# EasyEDA Pro project Balanced_Car.epro, schematic Schematic2
Board Name: V2; Create Date: 2024-09-10; Page Name: P1; Project Name: 平衡车; Schematic Name: Schematic2; Update Date: 2024-10-18; Company: 嘉立创EDA; Page Size: A4; Version: V1.0
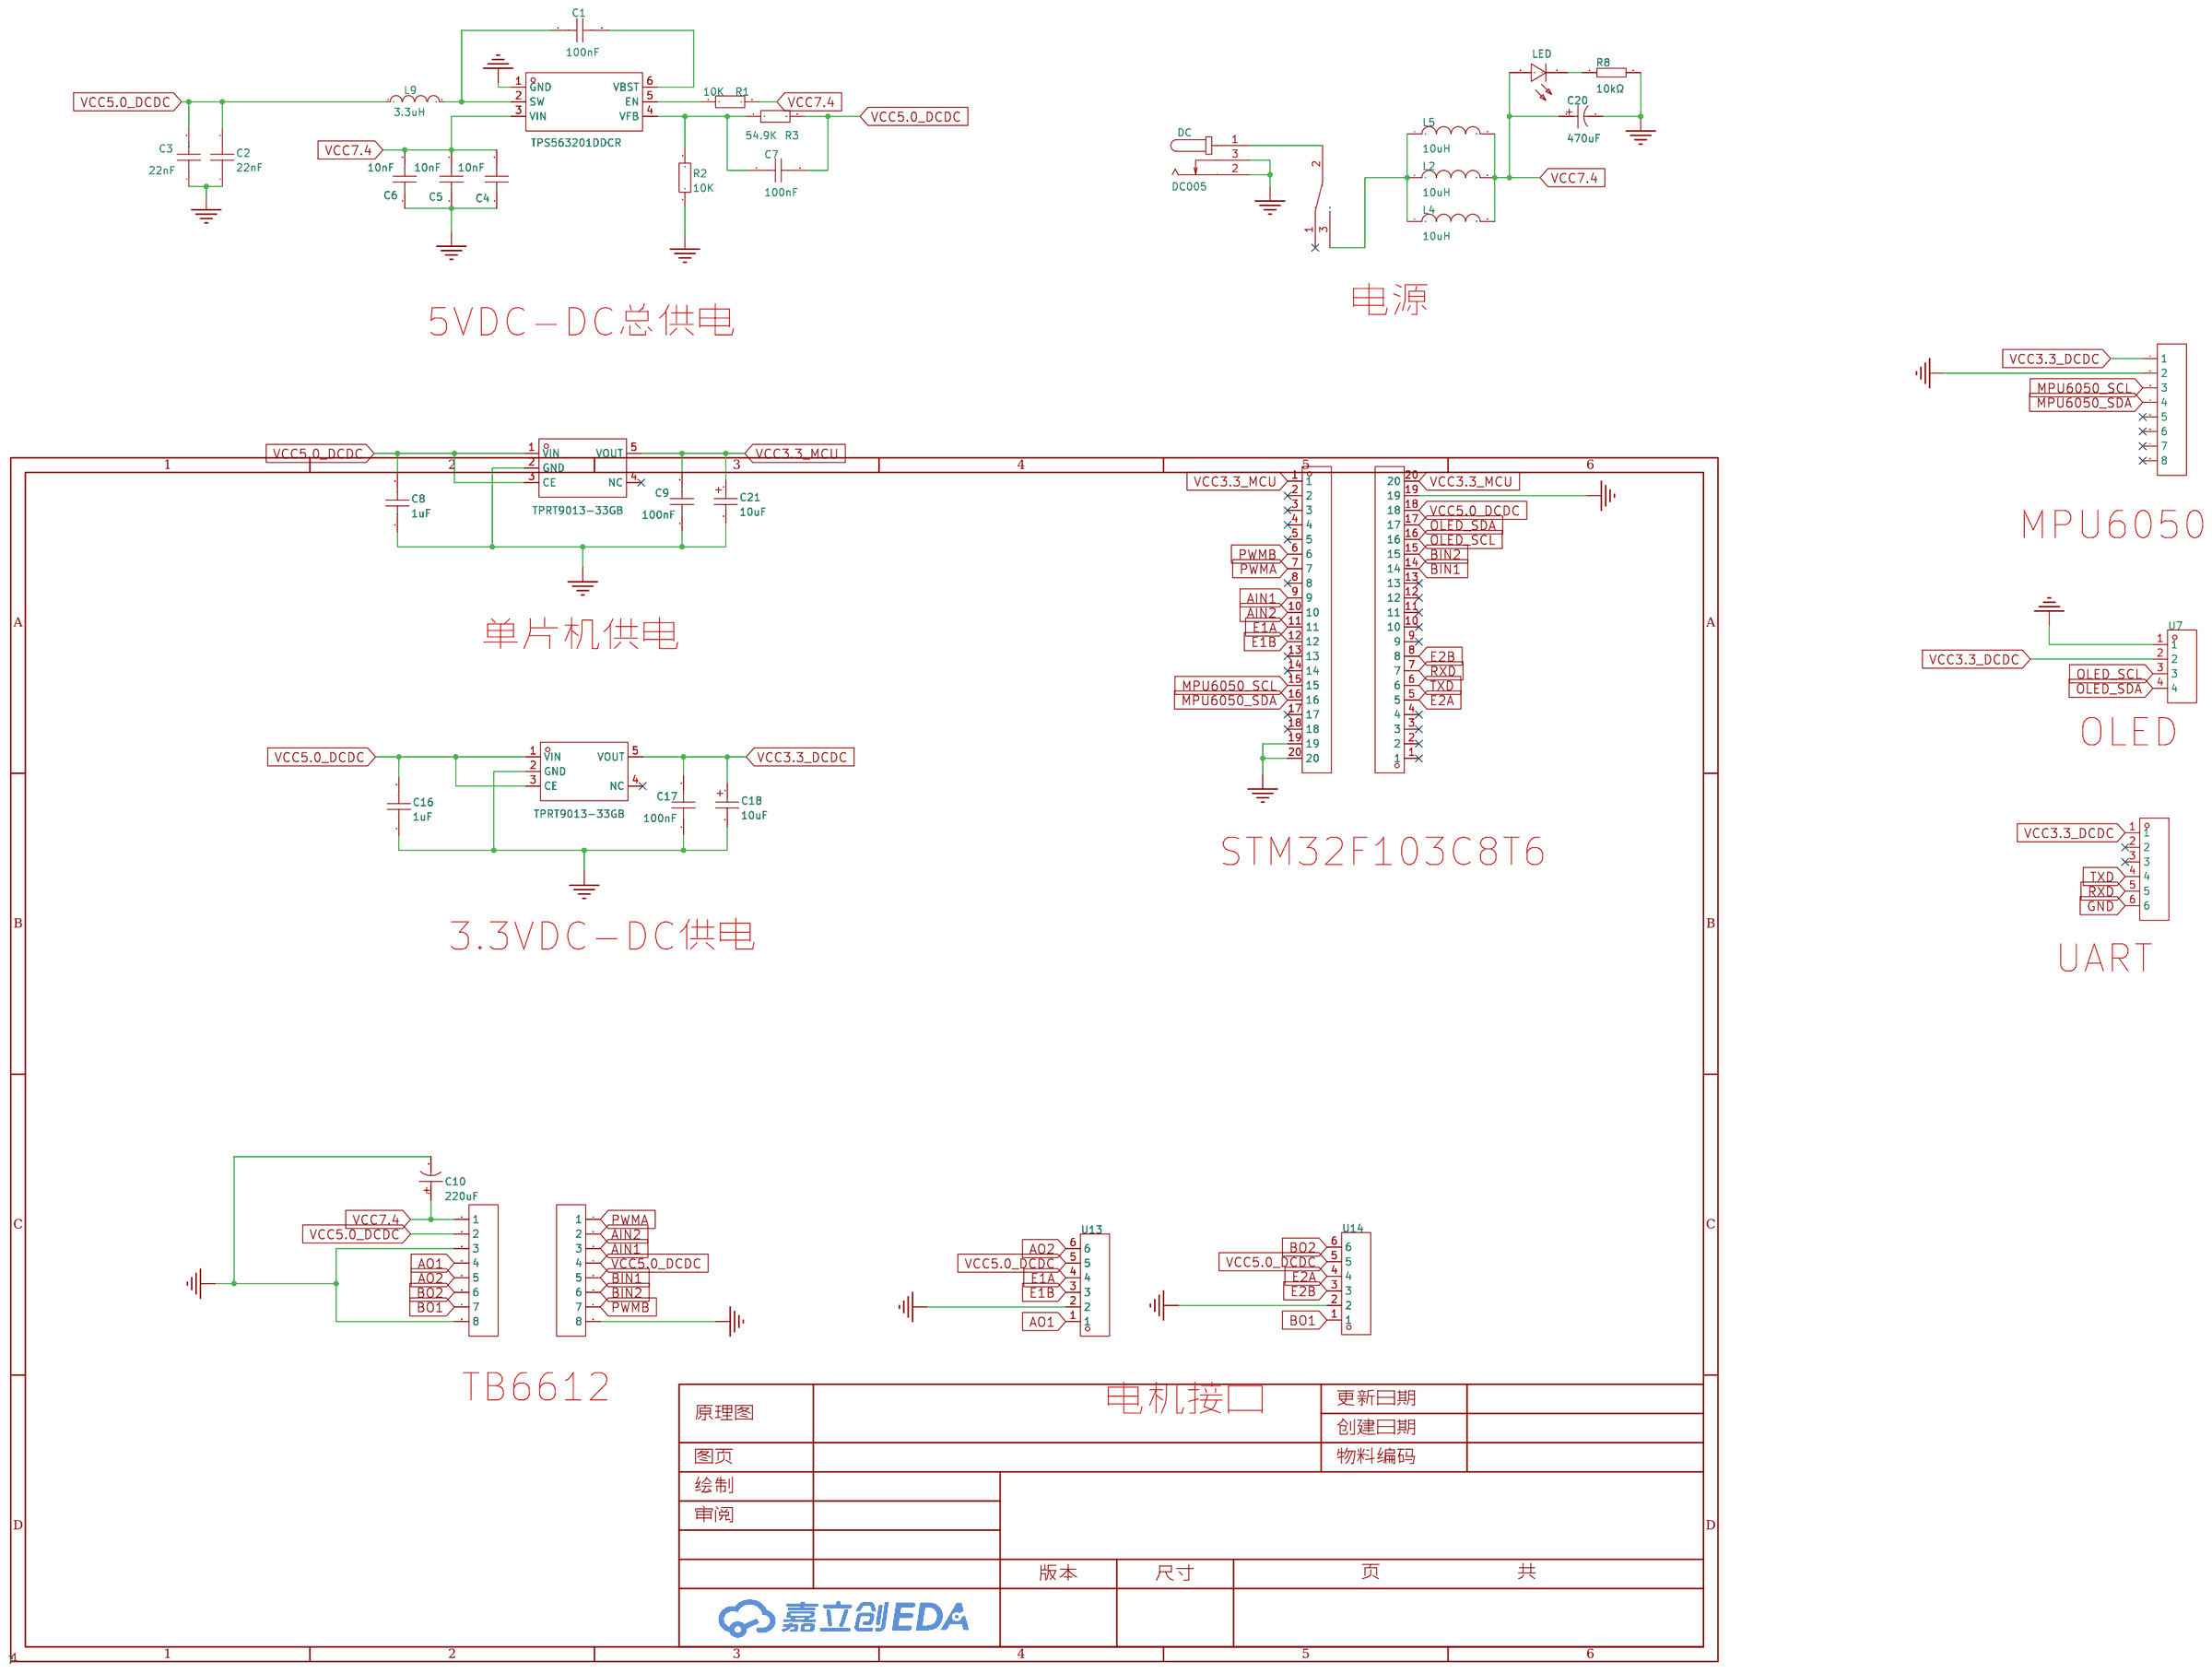
[diagram p0: schematic sheet]

## Parts
C1  100nF  [C0603]
C2  22nF  [C0603]
C3  22nF  [C0603]
C4  10nF  [C0603]
C5  10nF  [C0603]
C6  10nF  [C0603]
C7  100nF  [C0603]
C8  1uF  [C0603]
C9  100nF  [C0603]
C10  220uF  [CAP-TH_BD6.3-P2.50-D1.0-FD]
C16  1uF  [C0603]
C17  100nF  [C0603]
C18  10uF  [CAP-SMD_L3.2-W1.6-RD-C7171]
C20  470uF  [CAP-TH_BD8.0-P3.50-D0.6-FD]
C21  10uF  [CAP-SMD_L3.2-W1.6-RD-C7171]
DC  DC005  [DC-IN-TH_DC005]
H7  -  [HDR-TH_8P-P2.54-V-F-1]
H8  PM254V-11-06-H85  [HDR-TH_6P-P2.54-V-F]
L2  10uH  [L0805]
L4  10uH  [L0805]
L5  10uH  [L0805]
L9  3.3uH  [IND-SMD_L7.0-W6.6]
LED  NCD0603G1  [LED0603-RD]
R1  10K  [R0603]
R2  10K  [R0603]
R3  54.9K  [R0603]
R8  10kΩ  [R0805]
U1  TPS563201DDCR  [SOT-23-6_L2.9-W1.6-P0.95-LS2.8-BR]
U2  -  [HDR-TH_8P-P2.54-V-F-1]
U3  TPRT9013-33GB  [SOT-23-5_L3.0-W1.7-P0.95-LS2.8-BL]
U5  -  [HDR-TH_8P-P2.54-V-F-1]
U6  TPRT9013-33GB  [SOT-23-5_L3.0-W1.7-P0.95-LS2.8-BL]
U7  PM2.54-1*4  [HDR-TH_4P-P2.54-V-F]
U11  KH-2.54FH-1X20P-H8.5  [HDR-TH_20P-P2.54-V-F-2]
U12  KH-2.54FH-1X20P-H8.5  [HDR-TH_20P-P2.54-V-F-2]
U13  X8821WR-06S-N0SN  [CONN-TH_6P-P2.50_X8821WR-06S-N2SN]
U14  X8821WR-06S-N0SN  [CONN-TH_6P-P2.50_X8821WR-06S-N2SN]
U16  MT-0-102-A101-M200-RS  [SW-TH_MT-0-103-A101-M200-RS]

## Library data of the parts
C1-C9 C16 C17 = CAP_0603: Supplier Footprint: 0603
C10 = KS227M016E07RR0VH2FP0: 容值:220uF;精度:±20%;额定电压:16V;纹波电流:-;等效串联电阻:-;; LCSC Part Name: 220uF ±20% 16V; Supplier Part: C43340; Manufacturer: CX(承兴); Supplier Footprint: 插件,D6.3xL7mm; JLCPCB Part Class: 扩展库; Datasheet: https://atta.szlcsc.com/upload/public/pdf/source/20211027/7B10195EF01EB9374BE8935690E3D906.pdf; Supplier: LCSC; Tolerance: ±20%; Rated Voltage: 16V; Lead Spacing: 2.5mm; φD: 6.3mm; L: 7mm; Lifetime @ Temp: 1000hrs@105℃; Operating Temperature: -40℃~+105℃
C18 C21 = TAJA106K016RNJ: 容值:10uF;精度:±10%;额定电压:16V;等效串联电阻:3Ω@100kHz;; LCSC Part Name: 10uF ±10% 16V; Supplier Part: C7171; Manufacturer: Kyocera AVX; Supplier Footprint: CASE-A-3216; JLCPCB Part Class: 基础库; Datasheet: https://atta.szlcsc.com/upload/public/pdf/source/20160107/1457707750344.pdf; Supplier: LCSC; Tolerance: ±10%; Rated Voltage: 16V; Equivalent Series Resistance(ESR): 3Ω@100kHz; Operating Temperature: -55℃~+125℃
C20 = KM477M025F12RR0VH2FP0: 容值:470uF;精度:±20%;额定电压:25V;; LCSC Part Name: 470uF ±20% 25V; Supplier Part: C43839; Manufacturer: CX(承兴); Supplier Footprint: 插件,D8xL12mm; JLCPCB Part Class: 扩展库; Datasheet: https://atta.szlcsc.com/upload/public/pdf/source/20230915/80F12A3CAB98DAEEC2984174CA9E6511.pdf; Supplier: LCSC; Tolerance: ±20%; Rated Voltage: 25V; Lead Spacing: 3.5mm; φD: 8mm; L: 12mm; Lifetime @ Temp: 2000hrs@105℃
DC = DC005: 连接器类型:DC电源插座;安装方式:弯插;触点内径:2mm;触点外径:6.3mm;额定电流:500mA;额定电压:30V;工作温度范围:-40℃~+55℃;; LCSC Part Name: DC电源插座 内径:2mm 外径:6.3mm; Supplier Part: C431533; Manufacturer: SHOU HAN(首韩); Supplier Footprint: 插件; JLCPCB Part Class: 扩展库; Datasheet: https://atta.szlcsc.com/upload/public/pdf/source/20190925/C431533_4751811035784AC1D38EBC85F7905E99.pdf; Supplier: LCSC; Connector Type: DC电源插座; Mounting Style: 弯插; Inside Contact Diameter: 2mm; Outside Contact Diameter: 6.3mm; Current Rating (Max): 500mA; Voltage Rating (Max): 30V; Operating Temperature Range: -40℃~+55℃
H7 U2 U5 = HDR-F_2.54_1x8P: Supplier Part: C27438; Supplier Footprint: 插件; JLCPCB Part Class: 扩展库
H8 = PM254V-11-06-H85: 插孔结构:1x6P;间距:2.54mm;行距:-;圆孔/方孔:方孔;安装类型:直插;排数:单排;总孔位数:6P;额定电流:3A;额定电压:250V;插孔方向:顶部;塑高:-;工作温度范围:-40℃~+105℃;; LCSC Part Name: 间距:2.54mm 1x6P 直插; Supplier Part: C2832269; Manufacturer: XFCN(兴飞); Supplier Footprint: 插件,P=2.54mm; JLCPCB Part Class: 扩展库; Datasheet: https://atta.szlcsc.com/upload/public/pdf/source/20210514/C2832269_B3EC97736B37C2783BDCE3050AA57447.pdf; Supplier: LCSC; Holes Structure: 1x6P; Pitch: 2.54mm; Circular Hole / Square Hole: 方孔; Mounting Type: 直插; Number of Rows: 单排; Number of Holes: 6P; Current Rating (Max): 3A; Voltage Rating (Max): 250V; Holes Direction: 顶部; Operating Temperature Range: -40℃~+105℃
L2 L4 L5 = MGFL2012F100MT-LF: 电感值:10uH;精度:±20%;额定电流:500mA;饱和电流(Isat):-;直流电阻(DCR):320mΩ;; LCSC Part Name: 10uH ±20%; Supplier Part: C281113; Manufacturer: microgate(麦捷科技); Supplier Footprint: 0805; JLCPCB Part Class: Extended Part; Datasheet: https://atta.szlcsc.com/upload/public/pdf/source/20181025/C281113_18633E3AF8F2E9832A865B8532475DE8.pdf; Supplier: LCSC; Tolerance: ±20%; Rated Current: 500mA; DC Resistance (DCR): 320mΩ; Design Item ID: IND; Library Name: Fly
L9 = FXL0630-3R3-M: 电感值:3.3uH;精度:±20%;额定电流:8.5A;饱和电流(Isat):9.5A;类型:一体成型电感;; LCSC Part Name: 3.3uH ±20% 9.5A; Supplier Part: C167219; Manufacturer: cjiang(长江微电); Supplier Footprint: SMD,6.6x7mm; JLCPCB Part Class: 扩展库; Datasheet: https://atta.szlcsc.com/upload/public/pdf/source/20230516/3A080F5AF8C87BB81C3BA86E5F60E51A.pdf; Supplier: LCSC; Tolerance: ±20%; Rated Current: 8.5A; Saturation Current (Isat): 9.5A; DC Resistance (DCR): 22mΩ; Type: 一体成型电感
LED = NCD0603G1: 发光颜色:翠绿色;正向电压(VF):2.6V~3.6V;功率:72mW;正向电流:10mA;主波长:515nm~530nm;透镜颜色:无色透明透镜;发光强度:330mcd~900mcd;发光角度:130°;工作温度:-30℃~+85℃;; Supplier Part: C84267; Manufacturer: 国星光电; Supplier Footprint: 0603; JLCPCB Part Class: 扩展库; Datasheet: https://atta.szlcsc.com/upload/public/pdf/source/20200820/C84267_04BA7703640BAC111D09F5EFB971FBF3.pdf; Supplier: LCSC; Emitted Color: 翠绿色; Forward Voltage (VF): 2.6V~3.6V; Power Dissipation: 72mW; Forward Current: 10mA; Dominant Wavelength: 515nm~530nm; Lens Color: 无色透明透镜; Luminous Intensity: 330mcd~900mcd; Viewing Angle: 130°; Operating Temperature: -30℃~+85℃
R1-R3 = Res_0603: Supplier Footprint: 0603
R8 = 0805W8F1501T5E: 电阻类型:厚膜电阻;阻值:1.5kΩ;精度:±1%;功率:125mW;最大工作电压:150V;温度系数:±100ppm/℃;; LCSC Part Name: 1.5kΩ ±1% 125mW 厚膜电阻; Supplier Part: C4310; Manufacturer: UNI-ROYAL(厚声); Supplier Footprint: 0805; JLCPCB Part Class: Basic Part; Datasheet: https://atta.szlcsc.com/upload/public/pdf/source/20200306/C422600_1E6D84923E4A46A82E41ADD87F860B5C.pdf; Supplier: LCSC; Type: 厚膜电阻; Tolerance: ±1%; Power(Watts): 125mW; Overload Voltage (Max): 150V; Temperature Coefficient: ±100ppm/℃; Operating Temperature Range: -55℃~+155℃; Design Item ID: RES; Library Name: Fly
U1 = TPS563201DDCR: 功能类型:降压型;输出类型:可调;输入电压:4.5V~17V;输出电压:768mV~7V;输出电流:3A;; Supplier Part: C116592; Manufacturer: TI(德州仪器); Supplier Footprint: SOT-23-THIN-6; JLCPCB Part Class: 扩展库; Datasheet: https://atta.szlcsc.com/upload/public/pdf/source/20230424/FEEFD13F14AFA838E4C009B2DDC1DFA0.pdf; Supplier: LCSC; Function: 降压型; Output Type: 可调; Input Voltage: 4.5V~17V; Output Voltage: 768mV~7V; Output Current: 3A; Switching Frequency: 580kHz; Operating Temperature: -40℃~+125℃@(TJ); Synchronous Rectification: 是; Number of Outputs: 1; Topology: 降压式; Switch tube (built-in/external): 内置
U3 U6 = TPRT9013-33GB: 输出类型:-;; Supplier Part: C587158; Manufacturer: TECH PUBLIC(台舟); Supplier Footprint: SOT-23-5; JLCPCB Part Class: 扩展库; Datasheet: https://atta.szlcsc.com/upload/public/pdf/source/20210810/692D4D0C3CF190F9330EFD28C3E572CB.pdf; Supplier: LCSC
U7 = PM2.54-1*4: 插孔结构:1x4P;间距:2.54mm;行距:2.54mm;圆孔/方孔:方孔;安装类型:直插;排数:单排;总孔位数:4P;额定电流:2.5A;插孔方向:顶部;塑高:8.5mm;工作温度范围:-40℃~+105℃;; LCSC Part Name: 间距:2.54mm 1x4P 直插; Supplier Part: C5116530; Manufacturer: ZHOURI(洲日); Supplier Footprint: 插件,P=2.54mm; JLCPCB Part Class: 扩展库; Datasheet: https://atta.szlcsc.com/upload/public/pdf/source/20220729/3385E3C3A9122AF204A83235A2975C64.pdf; Supplier: LCSC; Holes Structure: 1x4P; Pitch: 2.54mm; Row Spacing: 2.54mm; Circular Hole / Square Hole: 方孔; Mounting Type: 直插; Number of Rows: 单排; Number of Holes: 4P; Current Rating (Max): 2.5A; Holes Direction: 顶部; Insulation Height: 8.5mm; Operating Temperature Range: -40℃~+105℃
U11 U12 = KH-2.54FH-1X20P-H8.5: 插孔结构:1x20P;间距:2.54mm;行距:-;圆孔/方孔:方孔;安装类型:直插;排数:单排;总孔位数:20P;额定电流:3A;额定电压:-;插孔方向:顶部;塑高:8.5mm;工作温度范围:-40℃~+105℃;; LCSC Part Name: 间距:2.54mm 1x20P 直插; Supplier Part: C2905423; Manufacturer: kinghelm(金航标); Supplier Footprint: 插件,P=2.54mm; JLCPCB Part Class: 扩展库; Datasheet: https://atta.szlcsc.com/upload/public/pdf/source/20211019/BDB673907948473CE61C8A1CF06C5BF5.pdf; Supplier: LCSC; Holes Structure: 1x20P; Pitch: 2.54mm; Circular Hole / Square Hole: 方孔; Mounting Type: 直插; Number of Rows: 单排; Number of Holes: 20P; Current Rating (Max): 3A; Holes Direction: 顶部; Insulation Height: 8.5mm; Operating Temperature Range: -40℃~+105℃
U13 U14 = X8821WR-06S-N0SN: 插针结构:1x6P;间距:2.5mm;安装方式:弯插;参考系列:XH;总PIN数:6P;排数:1;每排PIN数:6;行距:-;额定电流:3A;触头材质:黄铜;触头镀层:锡;工作温度范围:-;; LCSC Part Name: 1x6P 间距:2.5mm 弯插 系列:XH; Supplier Part: C388743; Manufacturer: XKB Connection(中国星坤); Supplier Footprint: 弯插,P=2.54mm; JLCPCB Part Class: 扩展库; Datasheet: https://atta.szlcsc.com/upload/public/pdf/source/20211009/984C14C41D2B1156BCF8EEF5D296E395.pdf; Supplier: LCSC; Pins Structure: 1x6P; Pitch: 2.5mm; Mounting Style: 弯插; Reference Series: XH; Number of Pins: 6P; Number of Rows: 1; Number of PINs Per Row: 6; Current Rating (Max): 3A; Contact Material: 黄铜; Contact Plating: 锡
U16 = MT-0-102-A101-M200-RS: 电路结构:单刀双掷;机械寿命:-;额定电流:5A;额定电压(AC):125V;安装方式:直插;; LCSC Part Name: 小型钮子三脚二档 五件套; Supplier Part: C1788492; Manufacturer: YUEN FUNG(源丰); Supplier Footprint: 插件; JLCPCB Part Class: 扩展库; Datasheet: https://atta.szlcsc.com/upload/public/pdf/source/20230720/8E5C36EFDF374AE4FF4AC09DB233CE0E.pdf; Supplier: LCSC; Circuit: 单刀双掷; Switch Length: 13mm; Switch Width: 8mm; Switch Height: 28.6mm; Contact Current: 5A; Voltage Rating (AC): 125V; Actuator Type: 圆柱钮柄; Pin Style: 焊片; Mounting Style: 直插; Operating Temperature: -25℃~+85℃

## Nets
GND: C2.1 C3.1 C4.1 C5.1 C6.1 C8.1 C9.1 C10.2 C16.1 C17.1 C18.2 C20.2 C21.2 DC.2 DC.3 H7.2 H8.6 R2.1 R8.2 U1.1(GND) U2.8 U3.2(GND) U5.3 U5.8 U6.2(GND) U7.1 U11.19 U11.20 U12.19 U13.2 U14.2
VCC3.3_DCDC: C17.2 C18.1 H7.1 H8.1 U6.5(VOUT) U7.2
VCC3.3_MCU: C9.2 C21.1 U3.5(VOUT) U11.1 U12.20
VCC5.0_DCDC: C2.2 C3.2 C7.2 C8.2 C16.2 L9.1 R3.2 U2.4 U3.1(VIN) U3.3(CE) U5.2 U6.1(VIN) U6.3(CE) U12.18 U13.5 U14.5
VCC7.4: C4.2 C5.2 C6.2 C10.1 C20.1 L2.2 L4.2 L5.2 LED.2(A) R1.2 U1.3(VIN) U5.1
AIN1: U2.3 U11.9
AIN2: U2.2 U11.10
AO1: U5.4 U13.1
AO2: U5.5 U13.6
BIN1: U2.5 U12.14
BIN2: U2.6 U12.15
BO1: U5.7 U14.1
BO2: U5.6 U14.6
E1A: U11.11 U13.4
E1B: U11.12 U13.3
E2A: U12.5 U14.4
E2B: U12.8 U14.3
MPU6050_SCL: H7.3 U11.15
MPU6050_SDA: H7.4 U11.16
OLED_SCL: U7.3 U12.16
OLED_SDA: U7.4 U12.17
PWMA: U2.1 U11.7
PWMB: U2.7 U11.6
RXD: H8.5 U12.7
TXD: H8.4 U12.6
$1N297: C1.2 U1.6(VBST)
$1N352: C1.1 L9.2 U1.2(SW)
$1N811: R1.1 U1.5(EN)
$1N888: C7.1 R2.2 R3.1 U1.4(VFB)
$1N8122: LED.1(K) R8.1
$1N8596: L2.1 L4.1 L5.1 U16.3
$1N8599: DC.1 U16.2

Not connected (* = marked no-connect by the designer): H7 5* 6* 7* 8*; H8 2* 3*; U3 4(NC)*; U6 4(NC)*; U11 2* 3* 4* 5* 8* 13* 14* 17* 18*; U12 1* 2* 3* 4* 9* 10* 11* 12* 13*; U16 1*

## Notes on the sheet
- 电源
- 5VDC-DC总供电
- MPU6050
- 单片机供电
- OLED
- STM32F103C8T6
- 3.3VDC-DC供电
- UART
- TB6612
- 电机接口
